# EAGLE design IR Receiver (EAGLE 7.7.0)
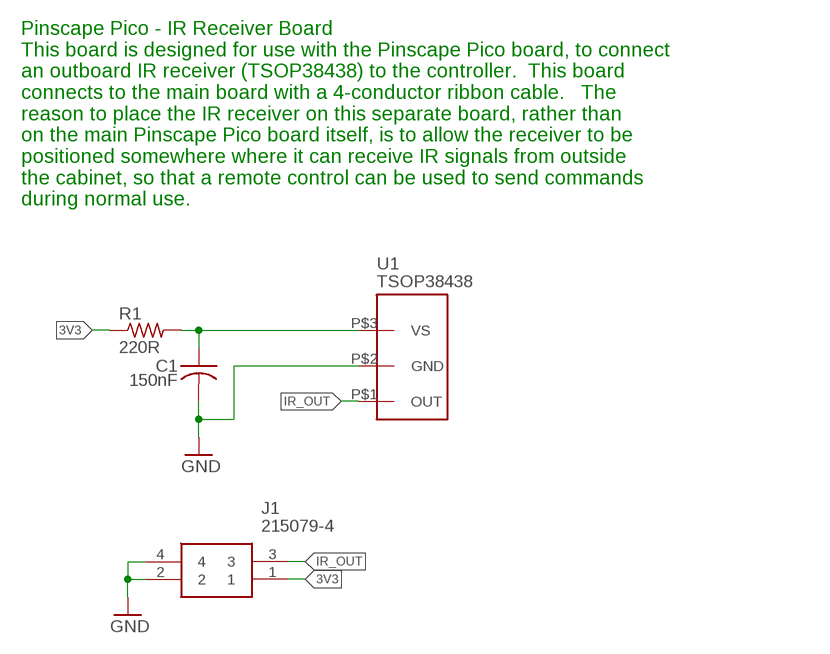
[diagram p0: schematic, sheet 1]

## Parts
C1  150nF  C-USC1206  [C1206]
J1  215079-4  [2150794]
R1  220R  R-US_R1206  [R1206]
U1  TSOP38438  TSOP382  [TSOP382]

## Nets
3V3: J1.1 R1.1
GND: C1.2 J1.2 J1.4 U1.P$2(GND)
IR_OUT: J1.3 U1.P$1(OUT)
N$61: C1.1 R1.2 U1.P$3(VS)

## Notes on the sheet
- Pinscape Pico - IR Receiver Board
  This board is designed for use with the Pinscape Pico board, to connect
  an outboard IR receiver (TSOP38438) to the controller.  This board
  connects to the main board with a 4-conductor ribbon cable.   The
  reason to place the IR receiver on this separate board, rather than
  on the main Pinscape Pico board itself, is to allow the receiver to be
  positioned somewhere where it can receive IR signals from outside
  the cabinet, so that a remote control can be used to send commands
  during normal use.

## Library data of the parts
C1 = rcl:C-US: CAPACITOR, American symbol
J1 = SamacSys_Parts:215079-4: Connector,F-o-B,PCB,Micro-MaTch,4W,top Source: Datasheet <https://www.te.com/commerce/DocumentDelivery/DDEController?Action=srchrtrv&DocNm=215079&DocType=Customer Drawing&DocLang=English>; DESCRIPTION: Connector,F-o-B,PCB,Micro-MaTch,4W,top; HEIGHT: 4.2mm; MANUFACTURER_NAME: TE Connectivity; MANUFACTURER_PART_NUMBER: 215079-4; MOUSER_PART_NUMBER: 571-215079-4; MOUSER_PRICE-STOCK: https://www.mouser.co.uk/ProductDetail/TE-Connectivity/215079-4?qs=O3N86PA0UL%252BdoZEVcFx8sQ%3D%3D
R1 = resistor:R-US_: RESISTOR, American symbol; PARTNO: 660-MS1/4DCT52R1002
U1 = TSOP382:TSOP382

## Board
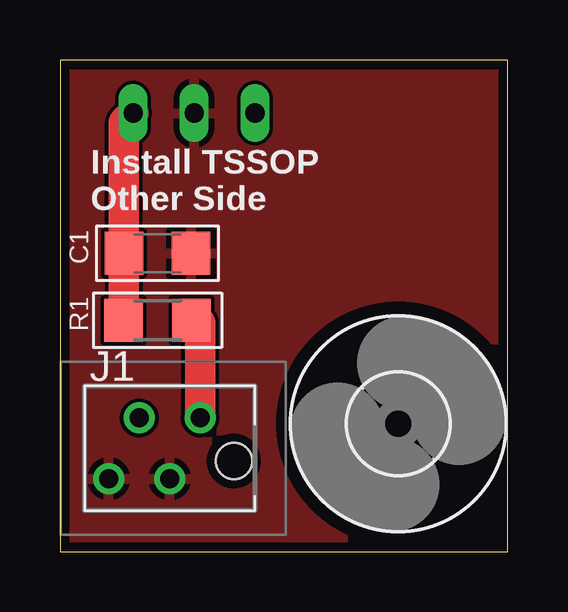
[diagram p1: board, top side]
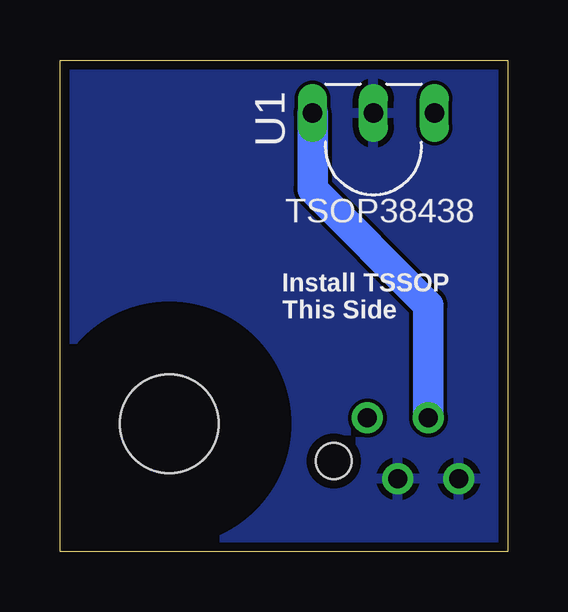
[diagram p2: board, bottom side, seen from below]

Size 18.65 x 20.5 mm. Coordinates in mm from the lower left corner, seen from the top.
Outline: 0,0 18.65,0 18.65,20.5 0,20.5 0,0
Copper layers (1*16): Top 0.035559375mm / dielectric 1.6mm / Bottom 0.035559375mm
Design rules "oshpark-2layer": minimum track width 6mil, minimum drill 10mil, track to track 6mil, track to pad 6mil, pad to pad 6mil, via to via 6mil, smd to smd 6mil, copper to edge 15mil, drill to drill 6mil, minimum pad ring 5mil, minimum via ring 5mil, stop-mask expansion 2.5mil, vias tented up to drill 0mil, thermal gap 10mil

### Footprints (pad centres in the part's own frame; a part is rotated, then mirrored left to right if it is on the bottom)
C1206 = smd 1.6 x 1.8: 1 -1.4,0; 2 1.4,0
2150794 = drill 0.8 pad 1.3: 1 0,0; 2 -1.27,-2.54; 3 -2.54,0; 4 -3.81,-2.54 | hole 1.5: 1.4,-1.8
R1206 = smd 1.6 x 1.803: 1 -1.422,0; 2 1.422,0
TSOP382 = drill 0.8 long: P$1 -2.54,0; P$2 0,0; P$3 2.54,0
4,1 = hole 4.1: 0,0

### Placement (x,y rotation side)
C1  4.06,12.45 0 top
J1  5.84,5.59 0 top
R1  4.06,9.65 180 top
U1  5.59,18.29 0 bottom
U$3  [4,1]  14.09,5.34 0 top

### Tracks (layer width: path | path; a pad name or v marks a point on that pad's centre or on a via)
3V3
  Top 1.27: J1.1 5.84,9.55 R1.1
GND
  pour Top: 18.67,20.57 0,20.57 0,0 18.67,0
  pour Bottom: 0,20.57 18.67,20.57 18.67,0 0,0
IR_OUT
  Bottom 1.27: U1.P$1 8.13,15.11 3.3,10.29 J1.3
N$61
  Top 1.27: U1.P$3 2.66,17.9 C1.1 2.66,9.93 R1.2

### Text on the board
tNames: Install TSSOP / Other Side
bNames: Install TSSOP / This Side